# Altium schematic sheet PowerSupply.SchDoc
size A3; SheetNumber: 3; SheetTotal: 3; SPICEModelCacheFNSMPQFO: <root> / <DocumentId>FNSMPQFO</DocumentId> / <CacheFrame Number="0"> / <Model Name="cap" Kind="MDL"> / <Text>*Default semiconductor capacitor / .MODEL CAP C()</Text> / </Model> / </CacheFrame> / </root>
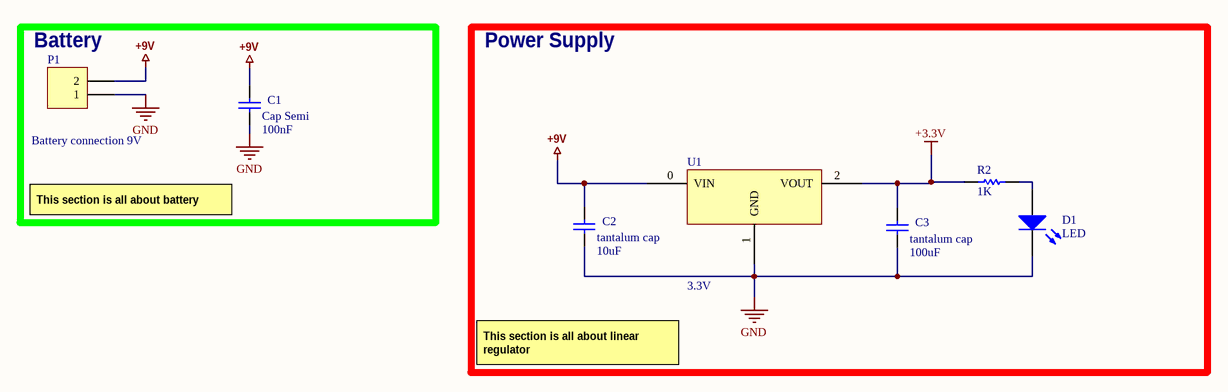
[diagram p0: PowerSupply.SchDoc]

## Parts
C1  Cap Semi  value 100nF  [C1206]
C2  tantalum cap  value 10uF  [C1206]
C3  tantalum cap  value 100uF  [C1206]
D1  LED  [MY_LED_0805]
P1  Battery connection 9V  [HDR1X2H]
R2  1K  [MY_0805]
U1  output voltage: 3.3V  [4-Pin SOT]

## Blocks framed on the sheet
Battery: C1 P1
Power Supply: C2 C3 D1 R2 U1

## Nets
+3.3V: C3.2 R2.1 U1.2(VOUT)
+9V: C1.2 C2.2 P1.2 U1.0(VIN)
GND: C1.1 C2.1 C3.1 D1.K P1.1 U1.1(GND)
NetD1_A: D1.A R2.2

## Notes on the sheet
- This section is all about battery
- This section is all about linear regulator

## Library data of the parts
C1-C3 = Cap Semi: Capacitor (Semiconductor SIM Model); Published: 8-Jun-2000; LatestRevisionDate: 29-May-2009; LatestRevisionNote: IPC-7351 Footprint Added.; PackageReference: C1206; Publisher: Altium Limited; PackageDescription: Chip Capacitor
D1 = LED: Typical INFRARED GaAs LED; ASiD Part Number: LED-AS
P1 = Header 2H: Header, 2-Pin, Right Angle; LatestRevisionDate: 17-Jul-2002; LatestRevisionNote: Re-released for DXP Platform.; Publisher: Altium Limited; Voltage: 9V
R2 = Res: Standard resistor; ASiD Part Number: Res-AS; Value: 1K
U1 = LM1117: The LM1117 is a low dropout voltage regulator with a / dropout of 1.2 V at 800 mA of load current; ComponentLink1Description: datasheet; ComponentLink1URL: https://www.ti.com/lit/gpn/LM1117